# Altium schematic sheet Bagryanets.SchDoc
size 594 x 420 mm; ApprovedBy: Круглов; Author: Краснинский; SheetNumber: 1; SheetTotal: 1; DocumentCode: МГТУ.464415.001 Э3; ListNumber: 1; DocType: Схема электрическая принципиальная; Name1: Модуль инфракрасный; Name2: универсальный; Organization1: МГТУ им Н.Э. Баумана; Organization2: кафедра РЛ1
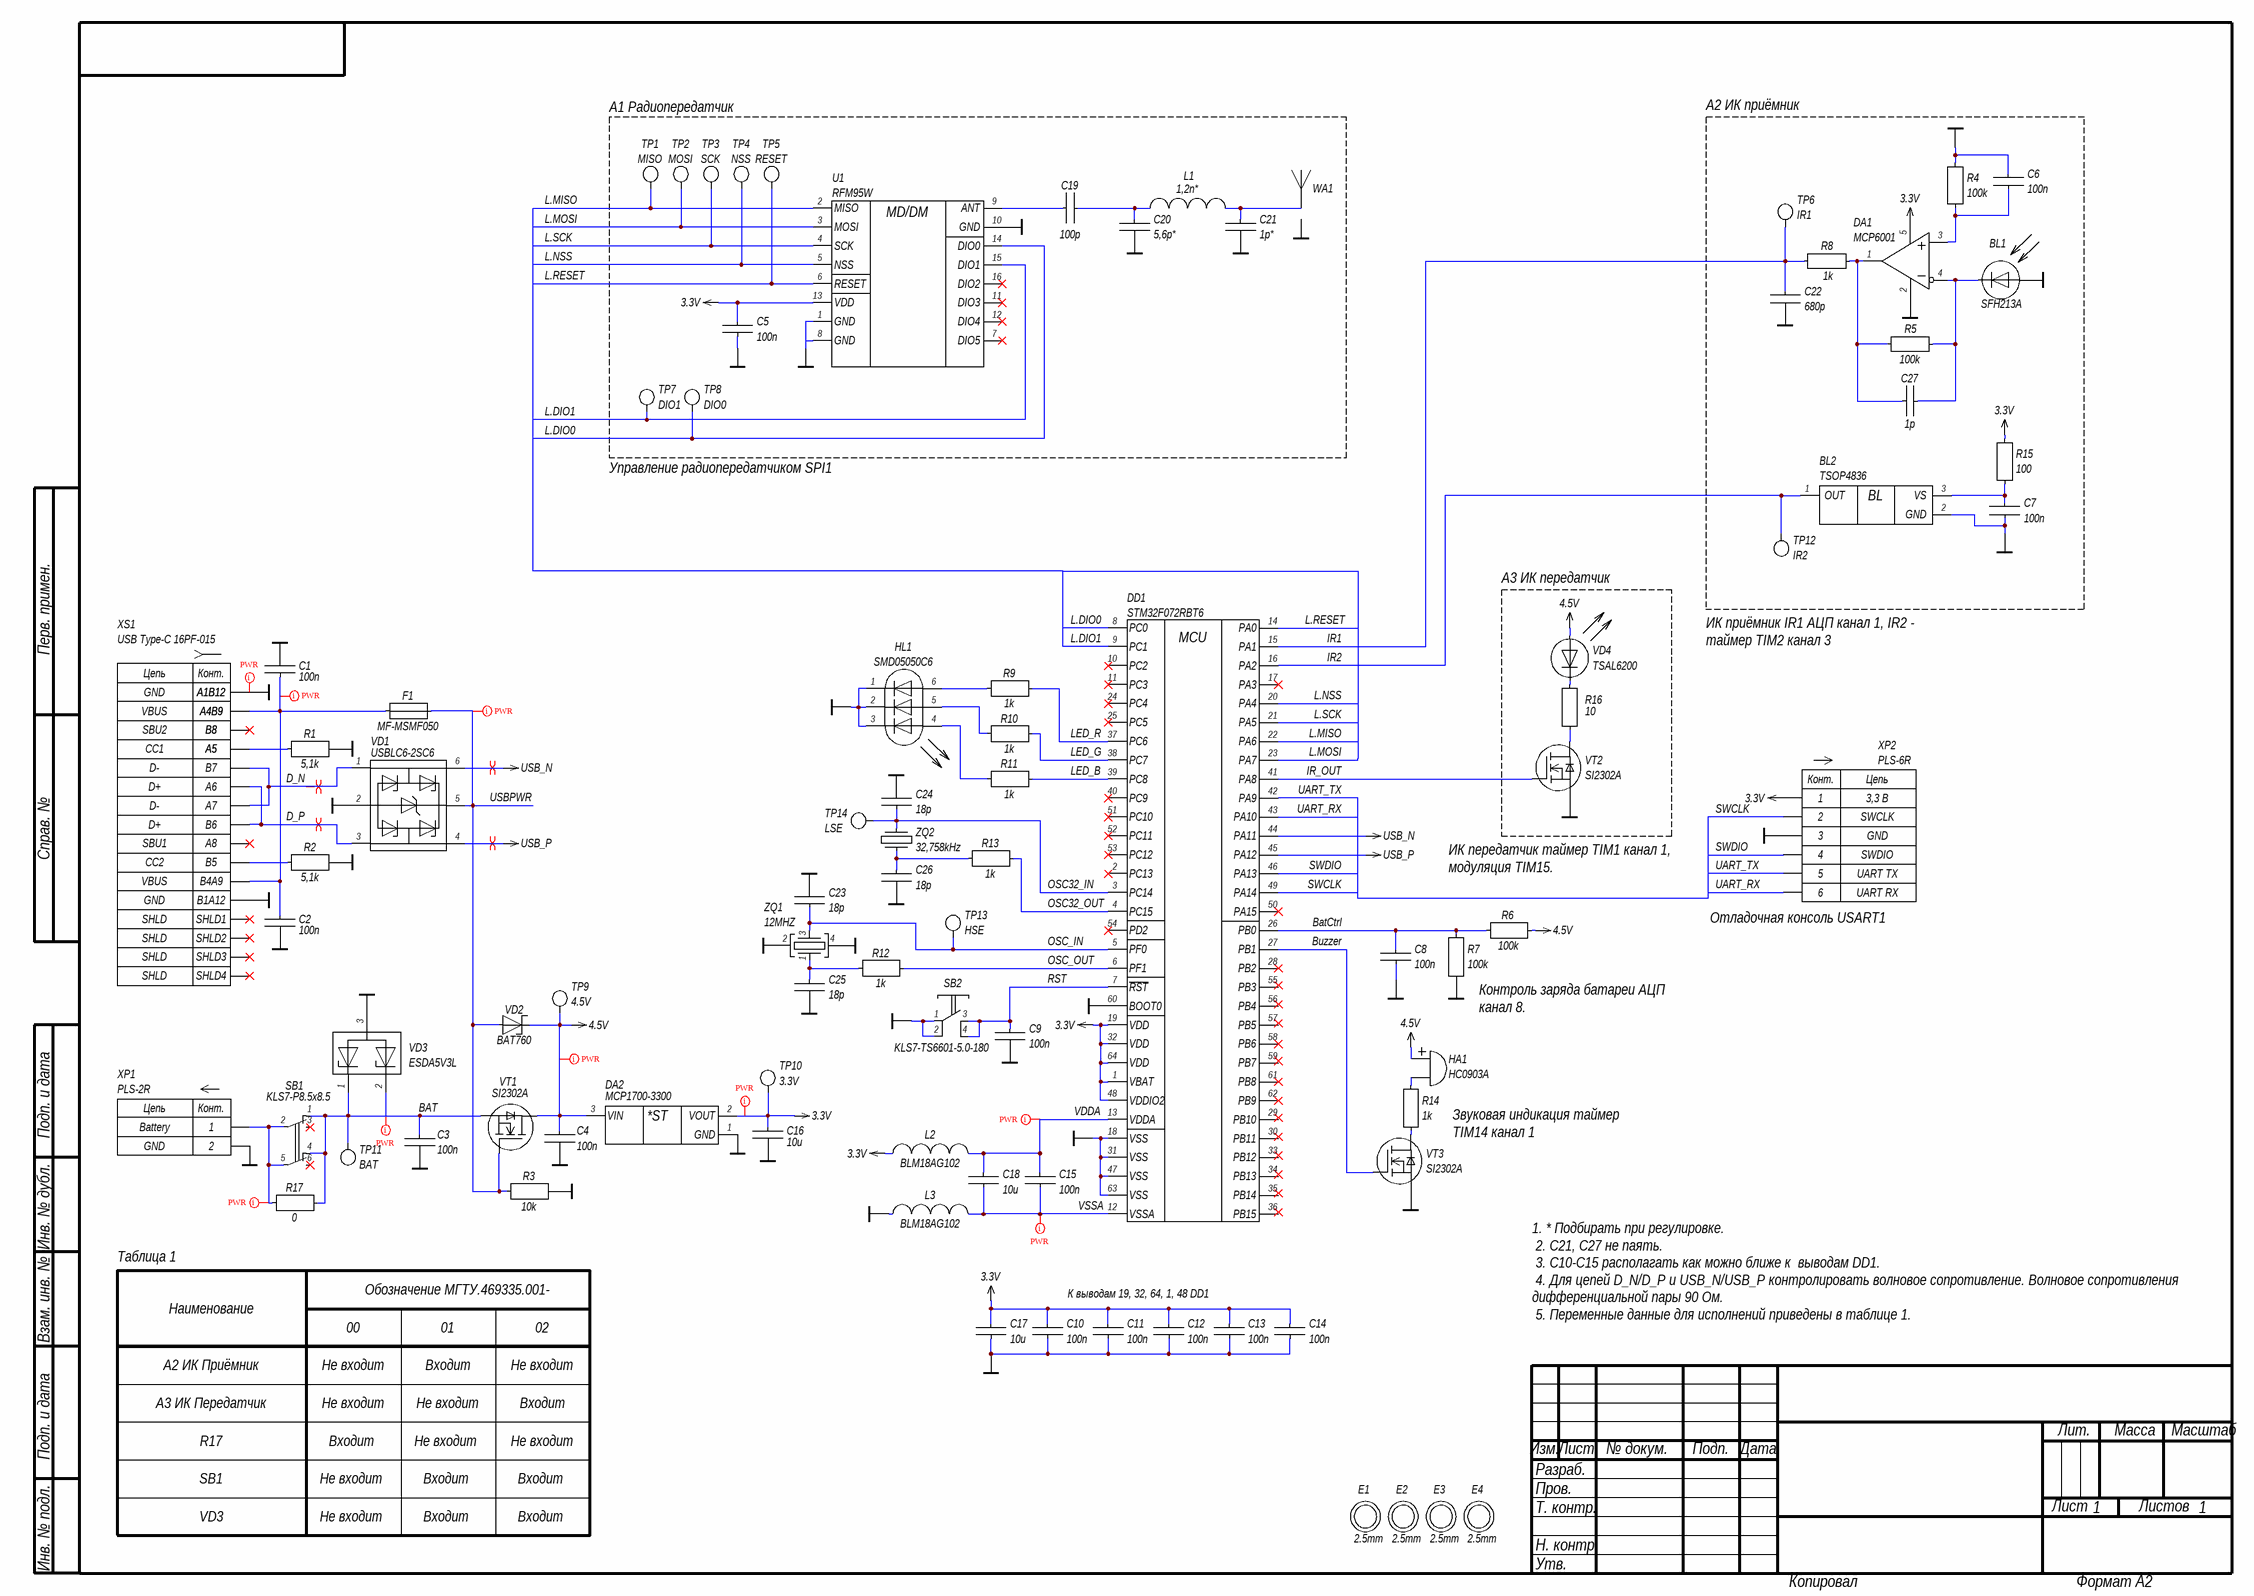
[diagram p0: Bagryanets.SchDoc]

## Parts
BL1  SFH213A  [LED_5mm]
BL2  TSOP4836  [TO92_TSOP4836_Horizontal]
C1  100n  [CAP: 0603]
C2  100n  [CAP: 0603]
C3  100n  [CAP: 0603]
C4  100n  [CAP: 0603]
C5  100n  [CAP: 0603]
C6  100n  [CAP: 0603]
C7  100n  [CAP: 0603]
C8  100n  [CAP: 0603]
C9  100n  [CAP: 0603]
C10  100n  [CAP: 0603]
C11  100n  [CAP: 0603]
C12  100n  [CAP: 0603]
C13  100n  [CAP: 0603]
C14  100n  [CAP: 0603]
C15  100n  [CAP: 0603]
C16  10u  [CAP: 0603]
C17  10u  [CAP: 0603]
C18  10u  [CAP: 0603]
C19  100p  [CAP: 0402]
C20  5,6p*  [CAP: 0402]
C21  1p*  [CAP: 0402]
C22  680p  [CAP: 0603]
C23  18p  [CAP: 0603]
C24  18p  [CAP: 0603]
C25  18p  [CAP: 0603]
C26  18p  [CAP: 0603]
C27  1p  [CAP: 0603]
DA1  MCP6001  [SOT23-5]
DA2  MCP1700-3300  [SOT23]
DD1  STM32F072RBT6  [64-LQFP]
E1  2.5mm  [HPTH 2.5mm]
E2  2.5mm  [HPTH 2.5mm]
E3  2.5mm  [HPTH 2.5mm]
E4  2.5mm  [HPTH 2.5mm]
F1  MF-MSMF050  [FUSE: 1812]
HA1  HC0903A  [Buzzer_9x5mm]
HL1  SMD05050C6  [LED_5050]
L1  1,2n*  [IND: 0402]
L2  BLM18AG102  [IND: 0603]
L3  BLM18AG102  [IND: 0603]
R1  5,1k  [RES: 0603]
R2  5,1k  [RES: 0603]
R3  10k  [RES: 0603]
R4  100k  [RES: 0603]
R5  100k  [RES: 0603]
R6  100k  [RES: 0603]
R7  100k  [RES: 0603]
R8  1k  [RES: 0603]
R9  1k  [RES: 0603]
R10  1k  [RES: 0603]
R11  1k  [RES: 0603]
R12  1k  [RES: 0603]
R13  1k  [RES: 0603]
R14  1k  [RES: 0603]
R15  100  [RES: 0603]
R16  10  [RES: 0603]
R17  0  [RES: 0603]
SB1  KLS7-P8.5x8.5  [SW-KLS7-P8.5x8.5]
SB2  KLS7-TS6601-5.0-180  [TactileButton6x6]
TP1  MISO  [Testpoint_1mm]
TP2  MOSI  [Testpoint_1mm]
TP3  SCK  [Testpoint_1mm]
TP4  NSS  [Testpoint_1mm]
TP5  RESET  [Testpoint_1mm]
TP6  IR1  [Testpoint_1mm]
TP7  DIO1  [Testpoint_1mm]
TP8  DIO0  [Testpoint_1mm]
TP9  4.5V  [Testpoint_1mm]
TP10  3.3V  [Testpoint_1mm]
TP11  BAT  [Testpoint_1mm]
TP12  IR2  [Testpoint_1mm]
TP13  HSE  [Testpoint_1mm]
TP14  LSE  [Testpoint_1mm]
U1  RFM95W  [Module_RFM95W]
VD1  USBLC6-2SC6  [SOT23-6]
VD2  BAT760  [DIODE: SOD323]
VD3  ESDA5V3L  [SOT23]
VD4  TSAL6200  [LED_5mm]
VT1  SI2302A  [SOT23]
VT2  SI2302A  [SOT23]
VT3  SI2302A  [SOT23]
WA1  Antenna  [WA-Lora868]  (value not drawn)
XP1  PLS-2R  [PLS-2R]
XP2  PLS-6R  [PLS-6R]
XS1  USB Type-C 16PF-015  [USB-C_16PF-015]
ZQ1  12MHZ  [OSC: 3225]
ZQ2  32,758kHz  [OSC: 3215]

## Blocks framed on the sheet
А1 Радиопередатчик: C5 C19-C21 L1 TP1-TP5 TP7 TP8 U1 WA1
А2 ИК приёмник: BL1 BL2 C6 C7 C22 C27 DA1 R4 R5 R8 R15 TP6 TP12
А3 ИК передатчик: R16 VD4 VT2

## Nets
3.3V: C5.2 C10.2 C11.2 C12.2 C13.2 C14.2 C16.2 C17.2 DA1.5(VDD) DA2.2(VOUT) DD1.1(VBAT) DD1.19(VDD) DD1.32(VDD) DD1.48(VDDIO2) DD1.64(VDD) L2.1 R15.1 TP10.1 U1.13(VDD) XP2.1
4.5V: C4.2 DA2.3(VIN) HA1.1 R6.1 TP9.1 VD2.C VD4.A VT1.3(D)
GND: BL1.A BL2.2(GND) C1.2 C2.1 C3.1 C4.1 C5.1 C6.2 C7.1 C8.1 C9.1 C10.1 C11.1 C12.1 C13.1 C14.1 C16.1 C17.1 C20.1 C21.1 C22.1 C23.2 C24.2 C25.1 C26.1 DA1.2(VSS) DA2.1(GND) DD1.18(VSS) DD1.31(VSS) DD1.47(VSS) DD1.60(BOOT0) DD1.63(VSS) HL1.1 HL1.2 HL1.3 L3.1 R1.1 R2.1 R3.2 R4.1 R7.2 SB2.1 SB2.2 U1.1(GND) U1.8(GND) U1.10(GND) VD1.2(GND) VD3.3 VT2.2(S) VT3.2(S) WA1.2 XP1.2 XP2.3 XS1.A1B12 XS1.B1A12 ZQ1.2 ZQ1.4
USB_N: DD1.44(PA11) VD1.6(IO1)
USB_P: DD1.45(PA12) VD1.4(IO2)
BAT: C3.2 R17.1 SB1.1 SB1.4 TP11.1 VD3.1 VD3.2 VT1.2(S)
BatCtrl: C8.2 DD1.26(PB0) R6.2 R7.1
Buzzer: DD1.27(PB1) VT3.1(G)
D_N: VD1.1(IO1) XS1.A7 XS1.B7
D_P: VD1.3(IO2) XS1.A6 XS1.B6
IR1: C22.2 DD1.15(PA1) R8.1 TP6.1
IR2: BL2.1(OUT) DD1.16(PA2) TP12.1
IR_OUT: DD1.41(PA8) VT2.1(G)
L.DIO0: DD1.8(PC0) TP8.1 U1.14(DIO0)
L.DIO1: DD1.9(PC1) TP7.1 U1.15(DIO1)
L.MISO: DD1.22(PA6) TP1.1 U1.2(MISO)
L.MOSI: DD1.23(PA7) TP2.1 U1.3(MOSI)
L.NSS: DD1.20(PA4) TP4.1 U1.5(NSS)
L.RESET: DD1.14(PA0) TP5.1 U1.6(RESET)
L.SCK: DD1.21(PA5) TP3.1 U1.4(SCK)
LED_B: DD1.39(PC8) R11.1
LED_G: DD1.38(PC7) R10.1
LED_R: DD1.37(PC6) R9.1
OSC32_IN: C24.1 DD1.3(PC14) TP14.1 ZQ2.2
OSC32_OUT: DD1.4(PC15) R13.1
OSC_IN: C23.1 DD1.5(PF0) TP13.1 ZQ1.3
OSC_OUT: DD1.6(PF1) R12.1
RST: C9.2 DD1.7(~{RST}) SB2.3 SB2.4
SWCLK: DD1.49(PA14) XP2.2
SWDIO: DD1.46(PA13) XP2.4
UART_RX: DD1.43(PA10) XP2.6
UART_TX: DD1.42(PA9) XP2.5
USBPWR: F1.2 R3.1 VD1.5(VCC) VD2.A VT1.1(G)
VDDA: C15.2 C18.2 DD1.13(VDDA) L2.2
VSSA: C15.1 C18.1 DD1.12(VSSA) L3.2
NetBL1_C: BL1.C C27.2 DA1.4(VIN-) R5.2
NetBL2_3: BL2.3(VS) C7.2 R15.2
NetC1_1: C1.1 C2.2 F1.1 XS1.A4B9 XS1.B4A9
NetC6_1: C6.1 DA1.3(VIN+) R4.2
NetC19_1: C19.1 C20.2 L1.1
NetC19_2: C19.2 U1.9(ANT)
NetC21_2: C21.2 L1.2 WA1.1
NetC25_2: C25.2 R12.2 ZQ1.1
NetC26_2: C26.2 R13.2 ZQ2.1
NetC27_1: C27.1 DA1.1(VOUT) R5.1 R8.2
NetHA1_2: HA1.2 R14.1
NetHL1_4: HL1.4 R11.2
NetHL1_5: HL1.5 R10.2
NetHL1_6: HL1.6 R9.2
NetR1_2: R1.2 XS1.A5
NetR2_2: R2.2 XS1.B5
NetR14_2: R14.2 VT3.3(D)
NetR16_1: R16.1 VD4.C
NetR16_2: R16.2 VT2.3(D)
NetR17_2: R17.2 SB1.2 SB1.5 XP1.1

Not connected (* = marked no-connect by the designer): DD1 2(PC13)* 10(PC2)* 11(PC3)* 17(PA3)* 24(PC4)* 25(PC5)* 28(PB2)* 29(PB10) 30(PB11) 33(PB12) 34(PB13) 35(PB14) 36(PB15) 40(PC9)* 50(PA15)* 51(PC10)* 52(PC11)* 53(PC12)* 54(PD2)* 55(PB3) 56(PB4) 57(PB5) 58(PB6)* 59(PB7) 61(PB8)* 62(PB9)*; SB1 3* 6*; U1 7(DIO5)* 11(DIO3)* 12(DIO4)* 16(DIO2)*; XS1 A8* B8* SHLD1* SHLD2* SHLD3* SHLD4*

## Layout directives
differential pair: D_N, D_P, USB_N, USB_P
net class Power: 3.3V, 4.5V, BAT, GND, NetC1_1, NetR17_2, USBPWR, VDDA, VSSA

## Notes on the sheet
- Управление радиопередатчиком SPI1
- ИК приёмник IR1 АЦП канал 1, IR2 - таймер TIM2 канал 3
- 3,3 B
- SWCLK
- GND
- ИК передатчик таймер TIM1 канал 1, модуляция TIM15.
- SWDIO
- UART TX
- UART RX
- (near XP2) Отладочная консоль USART1
- (near R7) Контроль заряда батареи АЦП канал 8.
- Battery
- Звуковая индикация таймер TIM14 канал 1
- Таблица 1
- Наименование
- 00
- 01
- Обозначение МГТУ.469335.001-
- 02
- К выводам 19, 32, 64, 1, 48 DD1
- А2 ИК Приёмник
- Не входит
- Входит
- 1. * Подбирать при регулировке.
  2. C21, C27 не паять.
  3. C10-C15 располагать как можно ближе к  выводам DD1.
  4. Для цепей D_N/D_P и USB_N/USB_P контролировать волновое сопротивление. Волновое сопротивления дифференциальной пары 90 Ом.
  5. Переменные данные для исполнений приведены в таблице 1.
- А3 ИК Передатчик
- R17
- SB1
- VD3
- Перв. примен.
- Справ. №
- Подп. и дата
- Инв. № дубл.
- Взам. инв. №
- Разраб.
- Изм.
- Лист
- № докум.
- Подп.
- Дата
- Лит.
- Масса
- Масштаб
- Пров.
- Т. контр.
- Листов
- Инв. № подл.
- Н. контр.
- Утв.
- Копировал
- Формат А2
- (in symbol BL-TSOP4836) BL
- (in symbol DA-MCP1700-3300) *ST
- (in symbol DD-STM32F072RBT6) MCU
- (in symbol MOD-RFM95W) MD/DM
- (in symbol XP-ConnectorPin-2_Table) Цепь; Конт.
- (in symbol XP-ConnectorPin-6_Table) Конт.; Цепь
- (in symbol XS-ConnectorUSB_C-16) Цепь; Конт.; GND; VBUS; SBU2; CC1; D-; D+; SBU1; CC2; SHLD

## Library data of the parts
BL1 = BL-Photodiod
BL2 = BL-TSOP4836
C1-C27 = C-Capacitor
DA1 = DA-MCP6001UT-I/OT: IC OPAMP GP 1 CIRCUIT SOT23-5; Number of Amplifiers: 1; Voltage: 6V; Power Supply Rejection Ratio (PSRR): 86dB; Common Mode Rejection Ratio: 60dB; Unity Gain Bandwidth Product: 1MHz; Slew Rate: 0.6V/µs; Output Current per Channel: 23mA; Nominal Supply Current: 100uA; Input Offset Voltage (Vos): 4.5mV; Input Bias Current: 1pA; Operating Supply Voltage: 5.5V; Min Supply Voltage: 1.8V; Voltage Gain: 112dB; Length: 3.1mm; REACH SVHC: No SVHC; Number of Pins: 5; Package Quantity: 1; Radiation Hardening: No; Mount: Surface Mount; Number of Circuits: 1; Number of Elements: 1; Output Current: 23mA; Packaging: Tape and Reel; Height: 1.3mm; Lead Free: Lead Free; Min Operating Temperature: -40°C; Bandwidth: 1MHz; Contact Plating: Tin; Max Supply Voltage: 6V; Max Operating Temperature: 85°C; Width: 1.8mm; Case/Package: SOT-23; Operating Supply Current: 100uA; Number of Channels: 1; Gain Bandwidth Product: 1MHz
DA2 = DA-MCP1700-3300
DD1 = DD-STM32F072RBT6: ARM® Cortex®-M0 STM32 F0 Microcontroller IC 32-Bit 48MHz 128KB (128K x 8) FLASH 64-LQFP (10x10); PartNumber: STM32F103CBT6TR; Manufacturer: STMicroelectronics; Supply Voltage(Vcc) min (V): 2; Packing: Tape and Reel; I/Os (High Current): 37; Operating Frequency(F) (Processor speed) (MHz): 72; A/D Converter: 2x12-bit (10 Channel); Core: ARM Cortex-M3; Internal RAM Size (kB): 20; FLASH Size (Prog) (kB): 128; ComponentLink1Description: Manufacturer URL; ComponentLink2Description: Datasheet; PackageReference: LQFP48; DatasheetVersion: Rev. 16; ComponentLink1URL: http://www.st.com/web/en/home.html; PackageDescription: 48-Pin Low Profile Quad Flat Package, 7 x 7 mm Body, 0.5 mm Pitch; ComponentLink3URL: http://www.st.com/st-web-ui/static/active/en/resource/technical/document/datasheet/DM00058181.pdf; ComponentLink2URL: http://www.st.com/st-web-ui/static/active/en/resource/technical/document/datasheet/CD00161566.pdf; PackageVersion: Rev. 6, 06/2013; Mounting Technology: Surface Mount; ComponentLink3Description: Package Specification; Supplier: Rs; Supplier Part Number: 9074757P; Manufacturer Part Number: STM32F072RBT6; RoHS: Yes; Category: Microcontrollers; Stock: 2446; Pricing: 10=4,9, 100=4,245, 250=4,04, 500=3,63 (GBP); ComponentLink4URL: https://datasheet.ciiva.com/48492/dm00090510-48492217.pdf?src-supplier=Avnet; ComponentLink4Description: https://datasheet.ciiva.com/48492/dm00090510-48492217.pdf?src-supplier=Avnet
E1-E4 = HPTH
F1 = FU-Fuse
HA1 = HA-Buzzer
HL1 = HL-LED_6
L1-L3 = L-Inductor
R1-R17 = R-Resistor
SB1 = SW-SPDT_2
SB2 = SW-PB
TP1-TP14 = TP-Testpoint
U1 = MOD-RFM95W: Rfm95W LoRa Transceiver Module 868Mhz; Sensitivity: -123dBm; Current - Receiving: 12.1mA; Current - Transmitting: 120mA; Max Supply Voltage: 3.7V; Min Supply Voltage: 1.8V; Nominal Supply Current: 5.8mA; Number of GPIO: 6NUMBER; ComponentLink1Description: Manufacturer URL; ComponentLink2Description: Datasheet; ComponentLink1URL: http://www.st.com/web/en/home.html; ComponentLink3URL: http://www.st.com/st-web-ui/static/active/en/resource/technical/document/datasheet/DM00058181.pdf; ComponentLink2URL: http://www.st.com/st-web-ui/static/active/en/resource/technical/document/datasheet/CD00161566.pdf; ComponentLink3Description: Package Specification; Clock Frequency: 868MHz; Height: 1.8mm; ComponentLink4URL: https://www.rfsolutions.co.uk/downloads/1463993415RFM95_96_97_98W.pdf?src-supplier=Digikey; ComponentLink4Description: https://www.rfsolutions.co.uk/downloads/1463993415RFM95_96_97_98W.pdf?src-supplier=Digikey
VD1 = VD-USBLC6-2SC6: ESD Suppressor Diode Arrays Uni-Dir 15kV@Air Gap/8kV@Contact Disc 6-Pin SOT-23 T/R; Manufacturer: STMicroelectronics; Direction: Unidirectional,Bidirectional; Value: 3.5pF; Operating Supply Voltage: 1.1V; Number of Channels: 2; Breakdown Voltage: 6V; Clamping Voltage: 17V; Reverse Standoff Voltage: 5.25V; Power Line Protection: Yes; Test Current: 1mA; Max Reverse Leakage Current: 150nA; Peak Pulse Current: 5A; Data Rate: 480Mbps; Number of Elements: 1; Working Voltage: 5V; Supplier: Rs; Supplier Part Number: 6247693P; Manufacturer Part Number: USBLC6-2SC6; RoHS: Yes; Category: TVS Diodes; Stock: 6950; Pricing: 10=101,409, 50=95,548, 100=90,505, 250=85,325, 500=81,1 (RUB); Mounting Technology: Surface Mount; Case/Package: SOT-23; Pins: 6; Min Operating Temperature: -40°C; Max Operating Temperature: 125°C; Packaging: Tape and Reel; Package Quantity: 3000; Termination: SMD/SMT; Number of Bidirectional Channels: 2; Min Breakdown Voltage: 6V; ESD Protection: Yes; Leakage Current: 150nA; Series: USB; Reverse Breakdown Voltage: 6V; Polarity: Unidirectional,Bidirectional; Max Breakdown Voltage: 6V; Clamping Voltage-Max: 17V; Max Repetitive Reverse Voltage (Vrrm): 5.25V; Length: 3.05mm; Width: 1.75mm; Height: 1.3mm; Depth: 1.75mm; Radiation Hardening: No; Lead Free: Lead Free; Reach SVHC Compliant: No; RoHS Compliant: Yes; ComponentLink1URL: https://datasheet.ciiva.com/1268/1690354-1268384.pdf?src-supplier=Element14; ComponentLink1Description: https://datasheet.ciiva.com/1268/1690354-1268384.pdf?src-supplier=Element14; ComponentLink2URL: https://datasheet.ciiva.com/4508/cd00050750-113117-4508433.pdf?src-supplier=Mouser; ComponentLink2Description: https://datasheet.ciiva.com/4508/cd00050750-113117-4508433.pdf?src-supplier=Mouser; ComponentLink3URL: https://datasheet.ciiva.com/15143/getdatasheetpartid-148465-15143789.pdf?src-supplier=Verical; ComponentLink3Description: https://datasheet.ciiva.com/15143/getdatasheetpartid-148465-15143789.pdf?src-supplier=Verical; ComponentLink4URL: https://datasheet.ciiva.com/16200/cd00050750-16200026.pdf?src-supplier=Future+Electronics; ComponentLink4Description: https://datasheet.ciiva.com/16200/cd00050750-16200026.pdf?src-supplier=Future+Electronics; ComponentLink5URL: https://datasheet.ciiva.com/41444/001184109-da-01-en-ic-esd-protecti-usblc6-2sc6-sot-23-6-stm-41444156.pdf?src-supplier=Conrad; ComponentLink5Description: https://datasheet.ciiva.com/41444/001184109-da-01-en-ic-esd-protecti-usblc6-2sc6-sot-23-6-stm-41444156.pdf?src-supplier=Conrad
VD2 = VD-Schottky
VD3 = VD-ESDA5V3L
VD4 = HL-LED
VT1-VT3 = VT-N-FET-GSD
WA1 = WA-Antenna_2pin
XP1 = XP-ConnectorPin-2_Table
XP2 = XP-ConnectorPin-6_Table
XS1 = XS-ConnectorUSB_C-16
ZQ1 = ZQ-XTAL_4
ZQ2 = ZQ-XTAL_2